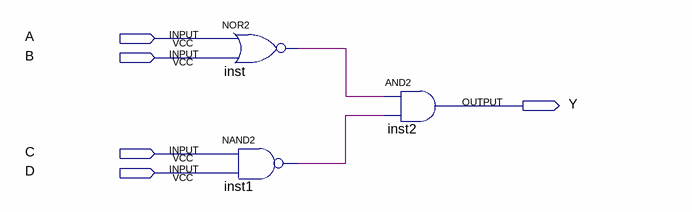
[diagram p0: schematic sheet]
// Quartus schematic SimpleGates.bdf as structural Verilog: 3 symbols, 5 pins
module SimpleGates (
  input  A,
  input  B,
  input  C,
  input  D,
  output Y
);

  wire inst1_out, inst_out;

  nor inst (inst_out, A, B);
  nand inst1 (inst1_out, C, D);
  and inst2 (Y, inst_out, inst1_out);
endmodule
